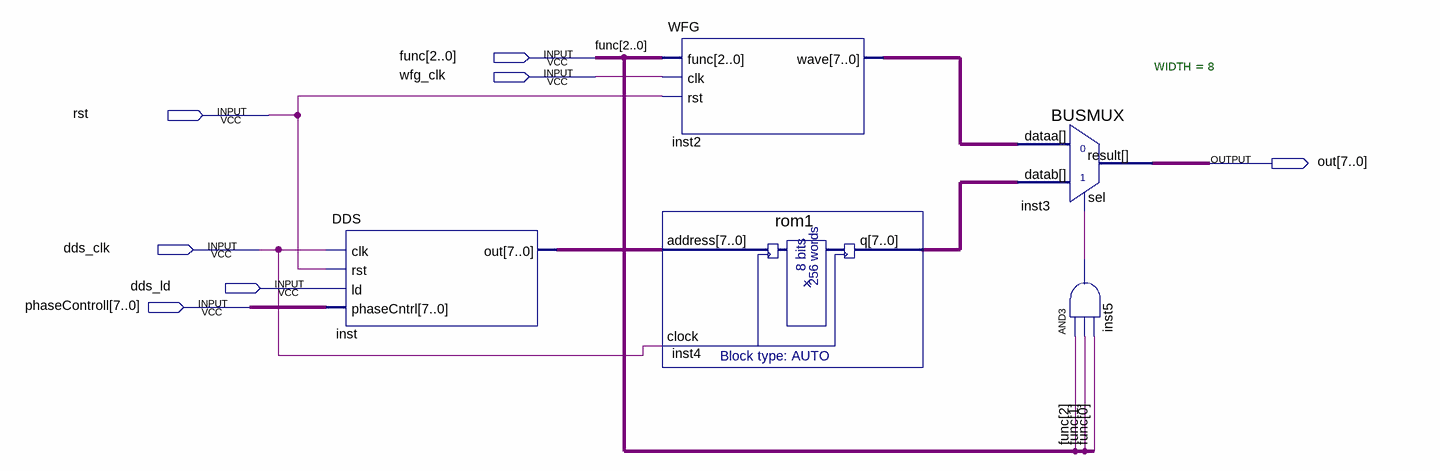
[diagram p0: schematic sheet]
// Quartus schematic WFG_DDS.bdf as structural Verilog: 5 symbols, 7 pins
module WFG_DDS (
  input  [2:0] func,
  input  wfg_clk,
  input  rst,
  input  dds_clk,
  input  dds_ld,
  input  [7:0] phaseControll,
  output [7:0] out
);

  wire inst5_out;
  wire [7:0] inst2_wave, inst4_q, inst_out;

  DDS inst (.clk(dds_clk), .rst(rst), .ld(dds_ld), .phaseCntrl(phaseControll), .out(inst_out));
  WFG inst2 (.func(func), .clk(wfg_clk), .rst(rst), .wave(inst2_wave));
  rom1 inst4 (.address(inst_out), .clock(dds_clk), .q(inst4_q));
  BUSMUX #(.WIDTH(8)) inst3 (.datab(inst4_q), .sel(inst5_out), .dataa(inst2_wave), .result(out));
  and inst5 (inst5_out, func[2], func[1], func[0]);
endmodule
